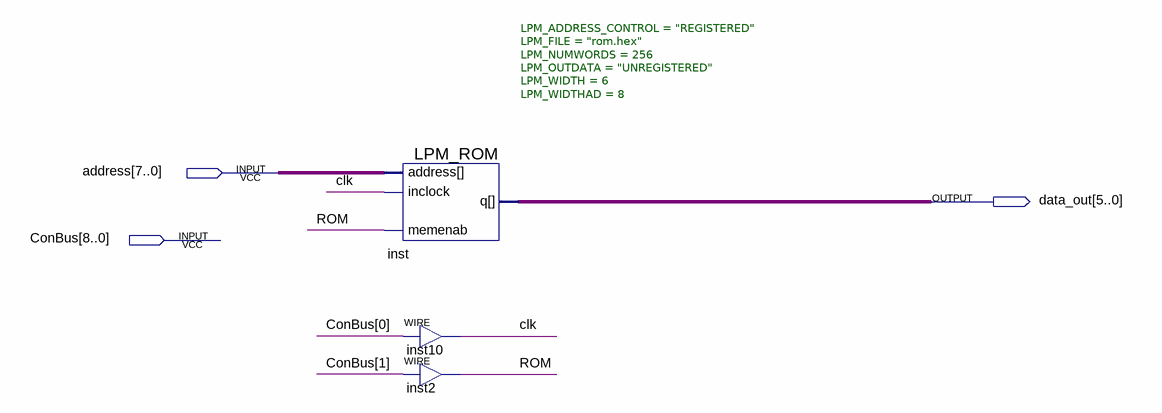
[diagram p0: schematic sheet]
// Quartus schematic rom.bdf as structural Verilog: 3 symbols, 3 pins
module rom (
  input  [7:0] address,
  input  [8:0] ConBus,
  output [5:0] data_out
);

  wire clk, ROM;

  LPM_ROM #(.LPM_ADDRESS_CONTROL("REGISTERED"), .LPM_FILE("rom.hex"), .LPM_NUMWORDS(256), .LPM_OUTDATA("UNREGISTERED"), .LPM_WIDTH(6), .LPM_WIDTHAD(8)) inst (
    .address(address), .inclock(clk), .memenab(ROM), .q(data_out));
  assign clk = ConBus[0];  // WIRE inst10
  assign ROM = ConBus[1];  // WIRE inst2
endmodule
